# Altium schematic sheet Gecko IO.SchDoc: Gecko IO
size A4; Organization: Energy Auditor; Address1: Sensor Node; Address3: University of Colorado; Address4: Boulder; DocumentNumber: 5; Revision: 1; SheetNumber: 5; SheetTotal: 6
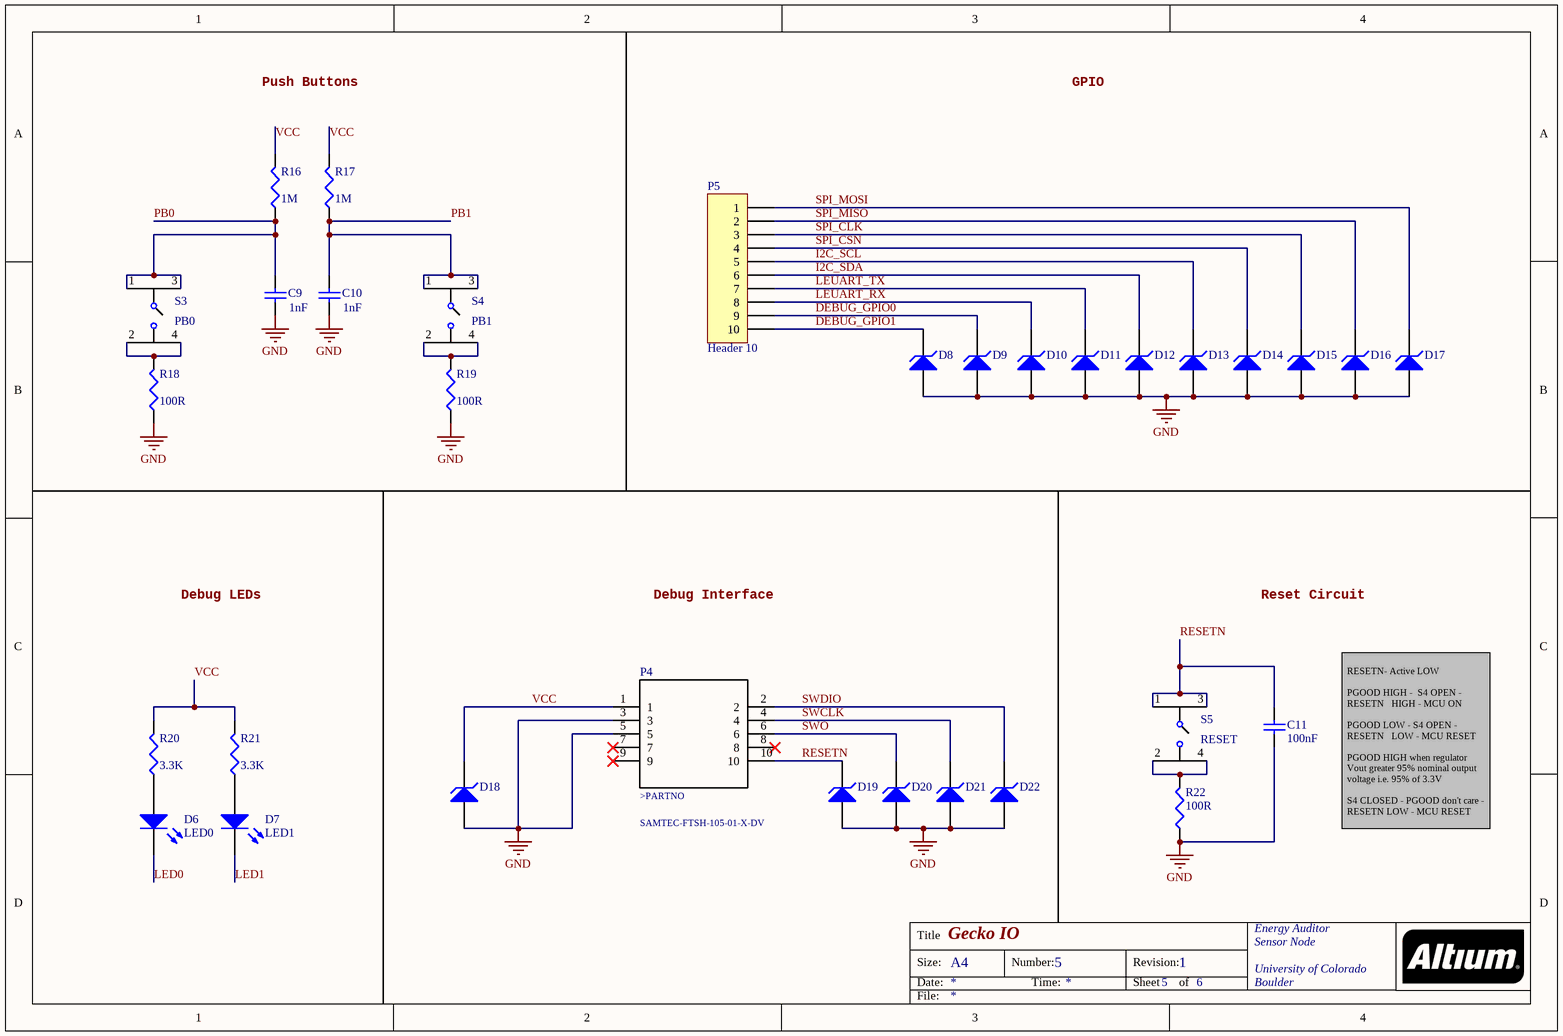
[diagram p0: Gecko IO.SchDoc]

## Parts
C9  1nF  [1608[0603]]
C10  1nF  [1608[0603]]
C11  100nF  [1608[0603]]
D6  LED0  [3.2X1.6X1.1]
D7  LED1  [3.2X1.6X1.1]
D8  D Zener  [0402]  (value not drawn)
D9  D Zener  [0402]  (value not drawn)
D10  D Zener  [0402]  (value not drawn)
D11  D Zener  [0402]  (value not drawn)
D12  D Zener  [0402]  (value not drawn)
D13  D Zener  [0402]  (value not drawn)
D14  D Zener  [0402]  (value not drawn)
D15  D Zener  [0402]  (value not drawn)
D16  D Zener  [0402]  (value not drawn)
D17  D Zener  [0402]  (value not drawn)
D18  D Zener  [0402]  (value not drawn)
D19  D Zener  [0402]  (value not drawn)
D20  D Zener  [0402]  (value not drawn)
D21  D Zener  [0402]  (value not drawn)
D22  D Zener  [0402]  (value not drawn)
P4  SAMTEC-FTSH-105-01-X-DV  [SAMTEC-FTSH-105-01-X-DV]  (value not drawn)
P5  Header 10  [HDR1X10]
R16  1M  [1608[0603]]
R17  1M  [1608[0603]]
R18  100R  [1608[0603]]
R19  100R  [1608[0603]]
R20  3.3K  [1608[0603]]
R21  3.3K  [1608[0603]]
R22  100R  [1608[0603]]
S3  PB0  [430182043816]
S4  PB1  [430182043816]
S5  RESET  [430182043816]

## Nets
GND: C9.1 C10.1 C11.2 D8.1(A) D9.1(A) D10.1(A) D11.1(A) D12.1(A) D13.1(A) D14.1(A) D15.1(A) D16.1(A) D17.1(A) D18.1(A) D19.1(A) D20.1(A) D21.1(A) D22.1(A) P4.3 P4.5 R18.1 R19.1 R22.1
DEBUG_GPIO0: D9.2(K) P5.9
DEBUG_GPIO1: D8.2(K) P5.10
I2C_SCL: D13.2(K) P5.5
I2C_SDA: D12.2(K) P5.6
LED0: D6.2(K)
LED1: D7.2(K)
LEUART_RX: D10.2(K) P5.8
LEUART_TX: D11.2(K) P5.7
PB0: C9.2 R16.1 S3.1 S3.3
PB1: C10.2 R17.1 S4.1 S4.3
RESETN: C11.1 D19.2(K) P4.10 S5.1 S5.3
SPI_CLK: D15.2(K) P5.3
SPI_CSN: D14.2(K) P5.4
SPI_MISO: D16.2(K) P5.2
SPI_MOSI: D17.2(K) P5.1
SWCLK: D21.2(K) P4.4
SWDIO: D22.2(K) P4.2
SWO: D20.2(K) P4.6
VCC: D18.2(K) P4.1 R16.2 R17.2 R20.2 R21.2
NetD6_1: D6.1(A) R20.1
NetD7_1: D7.1(A) R21.1
NetR18_2: R18.2 S3.2 S3.4
NetR19_2: R19.2 S4.2 S4.4
NetR22_2: R22.2 S5.2 S5.4

Not connected (* = marked no-connect by the designer): P4 7* 8* 9*

## Notes on the sheet
- Push Buttons
- GPIO
- Debug LEDs
- Debug Interface
- Reset Circuit
- RESETN- Active LOW
  PGOOD HIGH -  S4 OPEN -
  RESETN   HIGH - MCU ON
  PGOOD LOW - S4 OPEN -
  RESETN   LOW - MCU RESET
  PGOOD HIGH when regulator
  Vout greater 95% nominal output
  voltage i.e. 95% of 3.3V
  S4 CLOSED - PGOOD don't care -
  RESETN LOW - MCU RESET
- Title
- Size:
- Date:
- A4
- Number:
- Time:
- Revision:
- Sheet
- of
- File:
- (in symbol SAMTEC-FTSH-105-01-X-DV) >PARTNO

## Library data of the parts
C9 C10 = Cap: CAP CER 1000PF 50V X7R 0603; Manufacturer: AVX Corporation; Manufacturer Part Number: 06035C102JAT2A; Value: 1nF; Digi-Key Part Number: 478-5006-1-ND; ComponentLink1Description: Digi-Key Link; ComponentLink1URL: https://www.digikey.com/product-detail/en/avx-corporation/06035C102JAT2A/478-5006-1-ND/1888217
C11 = Cap: CAP CER 0.1UF 16V X7R 0603; Manufacturer: AVX Corporation; Manufacturer Part Number: 0603YC104MAT4A; Value: 100nF; Digi-Key Part Number: 478-7617-1-ND; ComponentLink1Description: Digi-Key Link; ComponentLink1URL: https://www.digikey.com/products/en/capacitors/ceramic-capacitors/60?k=capacitor&k=&pkeyword=capacitor&pv2049=u0.1%C2%B5F&sf=0&FV=c0005%2C1c0002%2C380009%2C400005%2C1f140000%2Cffe0003c&quantity=&ColumnSort=0&page=1&stock=1&pageSize=25
D6 D7 = LED2: LED GREEN DIFFUSED 0603 SMD; Manufacturer: OSRAM Opto Semiconductors Inc.; Manufacturer Part Number: LG L29K-F2J1-24-Z; Digi-Key Part Number: 475-3118-1-ND; ComponentLink1URL: https://www.digikey.com/product-detail/en/osram-opto-semiconductors-inc/LG-L29K-F2J1-24-Z/475-3118-1-ND/4899549; ComponentLink1Description: Digi-Key Link
D8-D22 = D Zener: TVS DIODE 5.5V 14V 2X1SON; Manufacturer Part Number: TPD1E10B06DPYR; Manufacturer: Texas Instruments; ComponentLink1URL: https://www.digikey.com/product-detail/en/texas-instruments/TPD1E10B06DPYR/296-30406-1-ND/3283560; ComponentLink1Description: Digi-Key Link; Value: *; Digi-Key Part Number: 296-30406-1-ND
P4 = SAMTEC-FTSH-105-01-X-DV: .050" X .050 TERMINAL STRIP; Manufacturer: Samtec; Manufacturer Part Number: FTSH-105-01-F-DV-K-TR; Value: *; Digi-Key Part Number: SAM13160CT-ND; ComponentLink1URL: https://www.digikey.com/products/en/connectors-interconnects/rectangular-connectors-headers-male-pins/314?k=FTSH-105-01-F-DV-K-TR&k=&pkeyword=FTSH-105-01-F-DV-K-TR&pv7=2&sf=0&quantity=&ColumnSort=0&page=1&pageSize=25; ComponentLink1Description: Digi-Key Link
P5 = Header 10: Header, 10-Pin
R16 R17 = Res3: RES SMD 1M OHM 5% 1/10W 0603; Manufacturer: Samsung Electro-Mechanics; Manufacturer Part Number: RC1608J105CS; Value: 1M; Digi-Key Part Number: 1276-5134-1-ND; ComponentLink1URL: https://www.digikey.com/product-detail/en/samsung-electro-mechanics/RC1608J105CS/1276-5134-1-ND/3968106; ComponentLink1Description: Digi-Key Link
R18 R19 R22 = Res3: RES SMD 100 OHM 5% 1/10W 0603; Manufacturer: Vishay Dale; Manufacturer Part Number: CRCW0603100RJNEAC; Value: 100R; Digi-Key Part Number: 541-4059-1-ND; ComponentLink1URL: https://www.digikey.com/product-detail/en/vishay-dale/CRCW0603100RJNEAC/541-4059-1-ND/7928742; ComponentLink1Description: Digi-Key Link
R20 R21 = Res3: RES SMD 3.3K OHM 5% 1/10W 0603; Manufacturer: Panasonic Electronic Components; Manufacturer Part Number: ERJ-3GEYJ332V; Value: 3.3K; Digi-Key Part Number: P3.3KGCT-ND; ComponentLink1URL: https://www.digikey.com/product-detail/en/panasonic-electronic-components/ERJ-3GEYJ332V/P3.3KGCT-ND/135146; ComponentLink1Description: Digi-Key Link
S3-S5 = 430182043816: SWITCH TACTILE SPST-NO 0.05A 12V; Manufacturer: Wurth Electronics; Manufacturer Part Number: 430182043816; Value: *; Digi-Key Part Number: 732-7004-1-ND; ComponentLink1URL: https://www.digikey.com/products/en/switches/tactile-switches/197?k=430+182+043+816&k=&pkeyword=430+182+043+816&pv7=2&sf=0&quantity=&ColumnSort=0&page=1&pageSize=25; ComponentLink1Description: Digi-Key Link